# EAGLE schematic main (EAGLE 8.2.2)
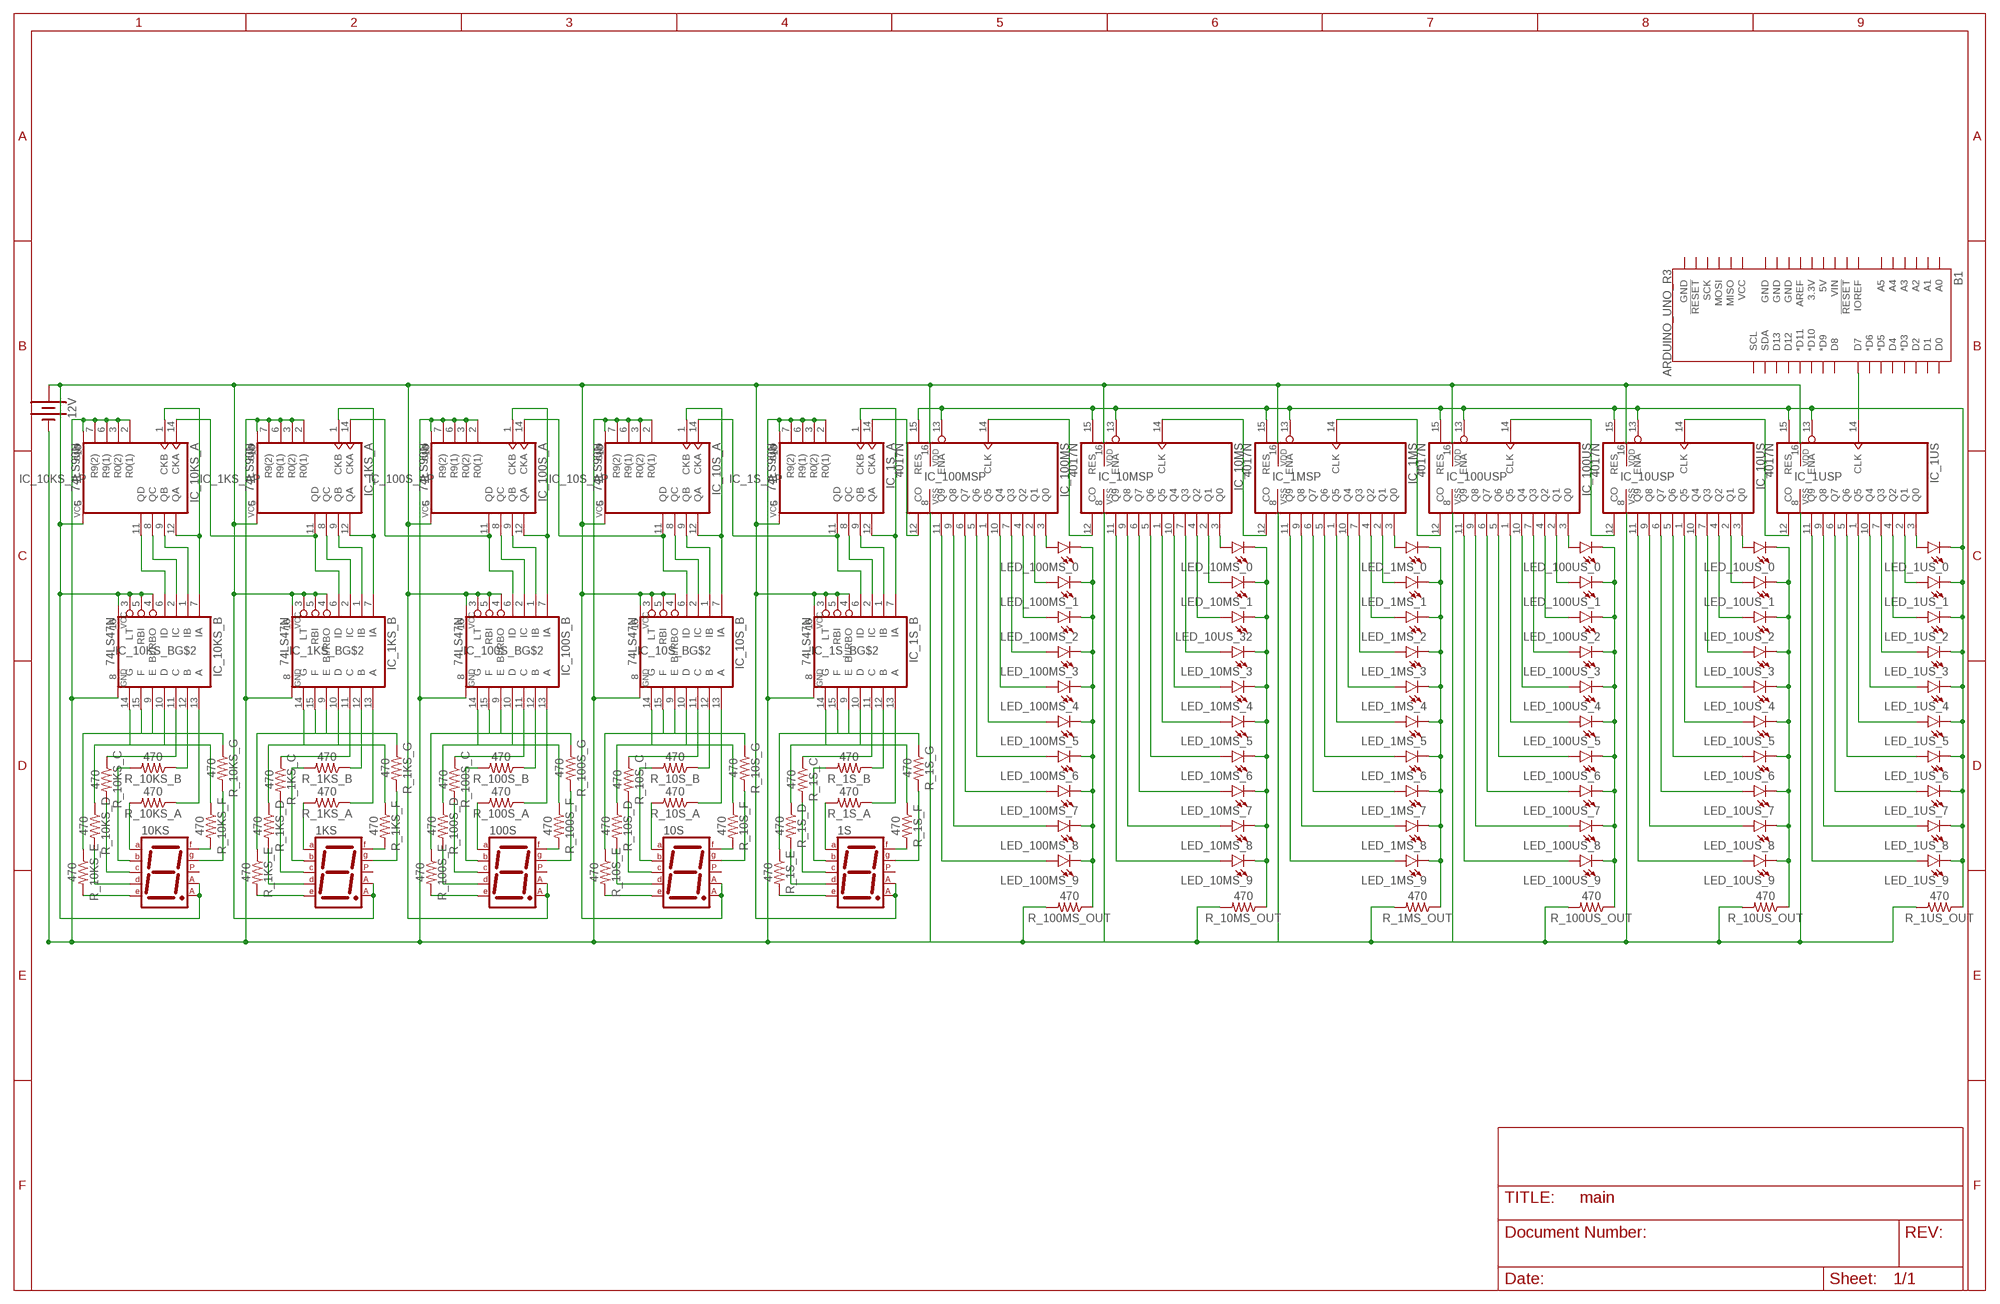
[diagram p0: schematic, sheet 1]

## Parts
1KS  7SEG-CA  [7SEG-13]
1S  7SEG-CA  [7SEG-13]
10KS  7SEG-CA  [7SEG-13]
10S  7SEG-CA  [7SEG-13]
12V  BATTERY-9V  [BATTCON_9V]
100S  7SEG-CA  [7SEG-13]
B1  ARDUINO_UNO_R3  [ARDUINO_R3]
IC_1KS_A  74LS90N  [DIL14]
IC_1KS_B  74LS47N  [DIL16]
IC_1MS  4017N  [DIL16]
IC_1S_A  74LS90N  [DIL14]
IC_1S_B  74LS47N  [DIL16]
IC_1US  4017N  [DIL16]
IC_10KS_A  74LS90N  [DIL14]
IC_10KS_B  74LS47N  [DIL16]
IC_10MS  4017N  [DIL16]
IC_10S_A  74LS90N  [DIL14]
IC_10S_B  74LS47N  [DIL16]
IC_10US  4017N  [DIL16]
IC_100MS  4017N  [DIL16]
IC_100S_A  74LS90N  [DIL14]
IC_100S_B  74LS47N  [DIL16]
IC_100US  4017N  [DIL16]
LED_1MS_0  LED3MM  [LED_3MM]
LED_1MS_1  LED3MM  [LED_3MM]
LED_1MS_2  LED3MM  [LED_3MM]
LED_1MS_3  LED3MM  [LED_3MM]
LED_1MS_4  LED3MM  [LED_3MM]
LED_1MS_5  LED3MM  [LED_3MM]
LED_1MS_6  LED3MM  [LED_3MM]
LED_1MS_7  LED3MM  [LED_3MM]
LED_1MS_8  LED3MM  [LED_3MM]
LED_1MS_9  LED3MM  [LED_3MM]
LED_1US_0  LED3MM  [LED_3MM]
LED_1US_1  LED3MM  [LED_3MM]
LED_1US_2  LED3MM  [LED_3MM]
LED_1US_3  LED3MM  [LED_3MM]
LED_1US_4  LED3MM  [LED_3MM]
LED_1US_5  LED3MM  [LED_3MM]
LED_1US_6  LED3MM  [LED_3MM]
LED_1US_7  LED3MM  [LED_3MM]
LED_1US_8  LED3MM  [LED_3MM]
LED_1US_9  LED3MM  [LED_3MM]
LED_10MS_0  LED3MM  [LED_3MM]
LED_10MS_1  LED3MM  [LED_3MM]
LED_10MS_3  LED3MM  [LED_3MM]
LED_10MS_4  LED3MM  [LED_3MM]
LED_10MS_5  LED3MM  [LED_3MM]
LED_10MS_6  LED3MM  [LED_3MM]
LED_10MS_7  LED3MM  [LED_3MM]
LED_10MS_8  LED3MM  [LED_3MM]
LED_10MS_9  LED3MM  [LED_3MM]
LED_10US_0  LED3MM  [LED_3MM]
LED_10US_1  LED3MM  [LED_3MM]
LED_10US_2  LED3MM  [LED_3MM]
LED_10US_3  LED3MM  [LED_3MM]
LED_10US_4  LED3MM  [LED_3MM]
LED_10US_5  LED3MM  [LED_3MM]
LED_10US_6  LED3MM  [LED_3MM]
LED_10US_7  LED3MM  [LED_3MM]
LED_10US_8  LED3MM  [LED_3MM]
LED_10US_9  LED3MM  [LED_3MM]
LED_10US_32  LED3MM  [LED_3MM]
LED_100MS_0  LED3MM  [LED_3MM]
LED_100MS_1  LED3MM  [LED_3MM]
LED_100MS_2  LED3MM  [LED_3MM]
LED_100MS_3  LED3MM  [LED_3MM]
LED_100MS_4  LED3MM  [LED_3MM]
LED_100MS_5  LED3MM  [LED_3MM]
LED_100MS_6  LED3MM  [LED_3MM]
LED_100MS_7  LED3MM  [LED_3MM]
LED_100MS_8  LED3MM  [LED_3MM]
LED_100MS_9  LED3MM  [LED_3MM]
LED_100US_0  LED3MM  [LED_3MM]
LED_100US_1  LED3MM  [LED_3MM]
LED_100US_2  LED3MM  [LED_3MM]
LED_100US_3  LED3MM  [LED_3MM]
LED_100US_4  LED3MM  [LED_3MM]
LED_100US_5  LED3MM  [LED_3MM]
LED_100US_6  LED3MM  [LED_3MM]
LED_100US_7  LED3MM  [LED_3MM]
LED_100US_8  LED3MM  [LED_3MM]
LED_100US_9  LED3MM  [LED_3MM]
R_1KS_A  470  470OHM-0603-1/10W-1%  [0603]
R_1KS_B  470  470OHM-0603-1/10W-1%  [0603]
R_1KS_C  470  470OHM-0603-1/10W-1%  [0603]
R_1KS_D  470  470OHM-0603-1/10W-1%  [0603]
R_1KS_E  470  470OHM-0603-1/10W-1%  [0603]
R_1KS_F  470  470OHM-0603-1/10W-1%  [0603]
R_1KS_G  470  470OHM-0603-1/10W-1%  [0603]
R_1MS_OUT  470  470OHM-0603-1/10W-1%  [0603]
R_1S_A  470  470OHM-0603-1/10W-1%  [0603]
R_1S_B  470  470OHM-0603-1/10W-1%  [0603]
R_1S_C  470  470OHM-0603-1/10W-1%  [0603]
R_1S_D  470  470OHM-0603-1/10W-1%  [0603]
R_1S_E  470  470OHM-0603-1/10W-1%  [0603]
R_1S_F  470  470OHM-0603-1/10W-1%  [0603]
R_1S_G  470  470OHM-0603-1/10W-1%  [0603]
R_1US_OUT  470  470OHM-0603-1/10W-1%  [0603]
R_10KS_A  470  470OHM-0603-1/10W-1%  [0603]
R_10KS_B  470  470OHM-0603-1/10W-1%  [0603]
R_10KS_C  470  470OHM-0603-1/10W-1%  [0603]
R_10KS_D  470  470OHM-0603-1/10W-1%  [0603]
R_10KS_E  470  470OHM-0603-1/10W-1%  [0603]
R_10KS_F  470  470OHM-0603-1/10W-1%  [0603]
R_10KS_G  470  470OHM-0603-1/10W-1%  [0603]
R_10MS_OUT  470  470OHM-0603-1/10W-1%  [0603]
R_10S_A  470  470OHM-0603-1/10W-1%  [0603]
R_10S_B  470  470OHM-0603-1/10W-1%  [0603]
R_10S_C  470  470OHM-0603-1/10W-1%  [0603]
R_10S_D  470  470OHM-0603-1/10W-1%  [0603]
R_10S_E  470  470OHM-0603-1/10W-1%  [0603]
R_10S_F  470  470OHM-0603-1/10W-1%  [0603]
R_10S_G  470  470OHM-0603-1/10W-1%  [0603]
R_10US_OUT  470  470OHM-0603-1/10W-1%  [0603]
R_100MS_OUT  470  470OHM-0603-1/10W-1%  [0603]
R_100S_A  470  470OHM-0603-1/10W-1%  [0603]
R_100S_B  470  470OHM-0603-1/10W-1%  [0603]
R_100S_C  470  470OHM-0603-1/10W-1%  [0603]
R_100S_D  470  470OHM-0603-1/10W-1%  [0603]
R_100S_E  470  470OHM-0603-1/10W-1%  [0603]
R_100S_F  470  470OHM-0603-1/10W-1%  [0603]
R_100S_G  470  470OHM-0603-1/10W-1%  [0603]
R_100US_OUT  470  470OHM-0603-1/10W-1%  [0603]

## Nets
N$1: IC_1US.3(Q0) LED_1US_0.A
N$2: IC_1US.2(Q1) LED_1US_1.A
N$3: IC_1US.4(Q2) LED_1US_2.A
N$4: IC_1US.7(Q3) LED_1US_3.A
N$5: IC_1US.10(Q4) LED_1US_4.A
N$6: IC_1US.1(Q5) LED_1US_5.A
N$7: IC_1US.5(Q6) LED_1US_6.A
N$8: IC_1US.6(Q7) LED_1US_7.A
N$9: IC_1US.9(Q8) LED_1US_8.A
N$10: IC_1US.11(Q9) LED_1US_9.A
N$11: IC_1MS.13(ENA) IC_1MS.15(RES) IC_1US.13(ENA) IC_1US.15(RES) IC_10MS.13(ENA) IC_10MS.15(RES) IC_10US.13(ENA) IC_10US.15(RES) IC_100MS.13(ENA) IC_100MS.15(RES) IC_100US.13(ENA) IC_100US.15(RES) LED_1US_0.K(C) LED_1US_1.K(C) LED_1US_2.K(C) LED_1US_3.K(C) LED_1US_4.K(C) LED_1US_5.K(C) LED_1US_6.K(C) LED_1US_7.K(C) LED_1US_8.K(C) LED_1US_9.K(C) R_1US_OUT.1
N$12: B1.D7 IC_1US.14(CLK)
N$13: IC_10US.3(Q0) LED_10US_0.A
N$14: IC_1S_A.14(CKA) IC_100MS.12(CO)
N$15: IC_1S_A.1(CKB) IC_1S_A.12(QA) IC_1S_B.7(IA)
N$16: IC_10US.2(Q1) LED_10US_1.A
N$17: IC_10US.4(Q2) LED_10US_2.A
N$18: IC_10US.7(Q3) LED_10US_3.A
N$19: IC_10US.10(Q4) LED_10US_4.A
N$20: IC_10US.1(Q5) LED_10US_5.A
N$21: IC_10US.5(Q6) LED_10US_6.A
N$22: IC_10US.6(Q7) LED_10US_7.A
N$23: IC_10US.9(Q8) LED_10US_8.A
N$24: IC_10US.11(Q9) LED_10US_9.A
N$25: LED_10US_0.K(C) LED_10US_1.K(C) LED_10US_2.K(C) LED_10US_3.K(C) LED_10US_4.K(C) LED_10US_5.K(C) LED_10US_6.K(C) LED_10US_7.K(C) LED_10US_8.K(C) LED_10US_9.K(C) R_10US_OUT.1
N$26: 12V.- IC_1S_A.2(R0(1)) IC_1S_A.3(R0(2)) IC_1S_A.6(R9(1)) IC_1S_A.7(R9(2)) IC_1S_A.10(GND) IC_1S_B.8(GND) IC_1US.8(VSS) IC_10US.8(VSS) R_1MS_OUT.2 R_1US_OUT.2 R_10MS_OUT.2 R_10US_OUT.2 R_100MS_OUT.2 R_100US_OUT.2
N$28: IC_1US.12(CO) IC_10US.14(CLK)
N$29: IC_100US.3(Q0) LED_100US_0.A
N$30: IC_100US.2(Q1) LED_100US_1.A
N$31: IC_100US.4(Q2) LED_100US_2.A
N$32: IC_100US.7(Q3) LED_100US_3.A
N$33: IC_100US.10(Q4) LED_100US_4.A
N$34: IC_100US.1(Q5) LED_100US_5.A
N$35: IC_100US.5(Q6) LED_100US_6.A
N$36: IC_100US.6(Q7) LED_100US_7.A
N$37: IC_100US.9(Q8) LED_100US_8.A
N$38: IC_100US.11(Q9) LED_100US_9.A
N$39: LED_100US_0.K(C) LED_100US_1.K(C) LED_100US_2.K(C) LED_100US_3.K(C) LED_100US_4.K(C) LED_100US_5.K(C) LED_100US_6.K(C) LED_100US_7.K(C) LED_100US_8.K(C) LED_100US_9.K(C) R_100US_OUT.1
N$40: IC_1S_A.9(QB) IC_1S_B.1(IB)
N$41: IC_100US.8(VSS)
N$42: IC_10US.12(CO) IC_100US.14(CLK)
N$43: IC_1MS.3(Q0) LED_1MS_0.A
N$44: IC_1MS.2(Q1) LED_1MS_1.A
N$45: IC_1MS.4(Q2) LED_1MS_2.A
N$46: IC_1MS.7(Q3) LED_1MS_3.A
N$47: IC_1MS.10(Q4) LED_1MS_4.A
N$48: IC_1MS.1(Q5) LED_1MS_5.A
N$49: IC_1MS.5(Q6) LED_1MS_6.A
N$50: IC_1MS.6(Q7) LED_1MS_7.A
N$51: IC_1MS.9(Q8) LED_1MS_8.A
N$52: IC_1MS.11(Q9) LED_1MS_9.A
N$53: LED_1MS_0.K(C) LED_1MS_1.K(C) LED_1MS_2.K(C) LED_1MS_3.K(C) LED_1MS_4.K(C) LED_1MS_5.K(C) LED_1MS_6.K(C) LED_1MS_7.K(C) LED_1MS_8.K(C) LED_1MS_9.K(C) R_1MS_OUT.1
N$54: IC_1S_A.8(QC) IC_1S_B.2(IC)
N$55: IC_1MS.8(VSS)
N$56: IC_1MS.14(CLK) IC_100US.12(CO)
N$57: IC_10MS.3(Q0) LED_10MS_0.A
N$58: IC_10MS.2(Q1) LED_10MS_1.A
N$59: IC_10MS.4(Q2) LED_10US_32.A
N$60: IC_10MS.7(Q3) LED_10MS_3.A
N$61: IC_10MS.10(Q4) LED_10MS_4.A
N$62: IC_10MS.1(Q5) LED_10MS_5.A
N$63: IC_10MS.5(Q6) LED_10MS_6.A
N$64: IC_10MS.6(Q7) LED_10MS_7.A
N$65: IC_10MS.9(Q8) LED_10MS_8.A
N$66: IC_10MS.11(Q9) LED_10MS_9.A
N$67: LED_10MS_0.K(C) LED_10MS_1.K(C) LED_10MS_3.K(C) LED_10MS_4.K(C) LED_10MS_5.K(C) LED_10MS_6.K(C) LED_10MS_7.K(C) LED_10MS_8.K(C) LED_10MS_9.K(C) LED_10US_32.K(C) R_10MS_OUT.1
N$69: IC_10MS.8(VSS)
N$70: IC_1MS.12(CO) IC_10MS.14(CLK)
N$71: IC_100MS.3(Q0) LED_100MS_0.A
N$72: IC_100MS.2(Q1) LED_100MS_1.A
N$73: IC_100MS.4(Q2) LED_100MS_2.A
N$74: IC_100MS.7(Q3) LED_100MS_3.A
N$75: IC_100MS.10(Q4) LED_100MS_4.A
N$76: IC_100MS.1(Q5) LED_100MS_5.A
N$77: IC_100MS.5(Q6) LED_100MS_6.A
N$78: IC_100MS.6(Q7) LED_100MS_7.A
N$79: IC_100MS.9(Q8) LED_100MS_8.A
N$80: IC_100MS.11(Q9) LED_100MS_9.A
N$81: LED_100MS_0.K(C) LED_100MS_1.K(C) LED_100MS_2.K(C) LED_100MS_3.K(C) LED_100MS_4.K(C) LED_100MS_5.K(C) LED_100MS_6.K(C) LED_100MS_7.K(C) LED_100MS_8.K(C) LED_100MS_9.K(C) R_100MS_OUT.1
N$82: IC_1S_B.9(E) R_1S_E.1
N$83: IC_100MS.8(VSS)
N$84: IC_10MS.12(CO) IC_100MS.14(CLK)
N$85: 1S.3(CA1) 1S.8(CA2) 12V.+ IC_1MS.16(VDD) IC_1S_A.5(VCC) IC_1S_B.3(LT) IC_1S_B.4(BI/RBO) IC_1S_B.5(RBI) IC_1S_B.16(VCC) IC_1US.16(VDD) IC_10MS.16(VDD) IC_10US.16(VDD) IC_100MS.16(VDD) IC_100US.16(VDD)
N$86: IC_1S_B.10(D) R_1S_D.1
N$87: IC_1S_B.11(C) R_1S_C.1
N$88: IC_1S_B.12(B) R_1S_B.1
N$89: 1S.7(A) R_1S_A.2
N$90: IC_1S_B.13(A) R_1S_A.1
N$91: 1S.10(G) R_1S_G.2
N$92: 1S.1(E) R_1S_E.2
N$93: 1S.2(D) R_1S_D.2
N$94: 1S.4(C) R_1S_C.2
N$95: 1S.6(B) R_1S_B.2
N$96: IC_1S_B.15(F) R_1S_G.1
N$97: IC_1S_B.14(G) R_1S_F.1
N$98: 1S.9(F) R_1S_F.2
N$99: 10S.3(CA1) 10S.8(CA2) IC_10S_A.5(VCC) IC_10S_B.3(LT) IC_10S_B.4(BI/RBO) IC_10S_B.5(RBI) IC_10S_B.16(VCC)
N$100: IC_1S_A.11(QD) IC_1S_B.6(ID) IC_10S_A.14(CKA)
N$101: IC_10S_A.1(CKB) IC_10S_A.12(QA) IC_10S_B.7(IA)
N$102: IC_10S_A.2(R0(1)) IC_10S_A.3(R0(2)) IC_10S_A.6(R9(1)) IC_10S_A.7(R9(2)) IC_10S_A.10(GND) IC_10S_B.8(GND)
N$103: IC_10S_A.9(QB) IC_10S_B.1(IB)
N$104: IC_10S_A.8(QC) IC_10S_B.2(IC)
N$106: 10S.1(E) R_10S_E.2
N$107: 10S.2(D) R_10S_D.2
N$108: 10S.4(C) R_10S_C.2
N$109: 10S.6(B) R_10S_B.2
N$110: IC_10S_B.15(F) R_10S_G.1
N$111: IC_10S_B.9(E) R_10S_E.1
N$112: IC_10S_B.10(D) R_10S_D.1
N$113: IC_10S_B.11(C) R_10S_C.1
N$114: IC_10S_B.12(B) R_10S_B.1
N$115: 10S.7(A) R_10S_A.2
N$116: IC_10S_B.13(A) R_10S_A.1
N$117: IC_10S_B.14(G) R_10S_F.1
N$118: 10S.9(F) R_10S_F.2
N$119: 10S.10(G) R_10S_G.2
N$141: 100S.3(CA1) 100S.8(CA2) IC_100S_A.5(VCC) IC_100S_B.3(LT) IC_100S_B.4(BI/RBO) IC_100S_B.5(RBI) IC_100S_B.16(VCC)
N$142: IC_10S_A.11(QD) IC_10S_B.6(ID) IC_100S_A.14(CKA)
N$143: IC_100S_A.1(CKB) IC_100S_A.12(QA) IC_100S_B.7(IA)
N$144: IC_100S_A.2(R0(1)) IC_100S_A.3(R0(2)) IC_100S_A.6(R9(1)) IC_100S_A.7(R9(2)) IC_100S_A.10(GND) IC_100S_B.8(GND)
N$145: IC_100S_A.9(QB) IC_100S_B.1(IB)
N$146: IC_100S_A.8(QC) IC_100S_B.2(IC)
N$148: 100S.1(E) R_100S_E.2
N$149: 100S.2(D) R_100S_D.2
N$150: 100S.4(C) R_100S_C.2
N$151: 100S.6(B) R_100S_B.2
N$152: IC_100S_B.15(F) R_100S_G.1
N$153: IC_100S_B.9(E) R_100S_E.1
N$154: IC_100S_B.10(D) R_100S_D.1
N$155: IC_100S_B.11(C) R_100S_C.1
N$156: IC_100S_B.12(B) R_100S_B.1
N$157: 100S.7(A) R_100S_A.2
N$158: IC_100S_B.13(A) R_100S_A.1
N$159: IC_100S_B.14(G) R_100S_F.1
N$160: 100S.9(F) R_100S_F.2
N$161: 100S.10(G) R_100S_G.2
N$162: 1KS.3(CA1) 1KS.8(CA2) IC_1KS_A.5(VCC) IC_1KS_B.3(LT) IC_1KS_B.4(BI/RBO) IC_1KS_B.5(RBI) IC_1KS_B.16(VCC)
N$163: IC_1KS_A.14(CKA) IC_100S_A.11(QD) IC_100S_B.6(ID)
N$164: IC_1KS_A.1(CKB) IC_1KS_A.12(QA) IC_1KS_B.7(IA)
N$165: IC_1KS_A.2(R0(1)) IC_1KS_A.3(R0(2)) IC_1KS_A.6(R9(1)) IC_1KS_A.7(R9(2)) IC_1KS_A.10(GND) IC_1KS_B.8(GND)
N$166: IC_1KS_A.9(QB) IC_1KS_B.1(IB)
N$167: IC_1KS_A.8(QC) IC_1KS_B.2(IC)
N$169: 1KS.1(E) R_1KS_E.2
N$170: 1KS.2(D) R_1KS_D.2
N$171: 1KS.4(C) R_1KS_C.2
N$172: 1KS.6(B) R_1KS_B.2
N$173: IC_1KS_B.15(F) R_1KS_G.1
N$174: IC_1KS_B.9(E) R_1KS_E.1
N$175: IC_1KS_B.10(D) R_1KS_D.1
N$176: IC_1KS_B.11(C) R_1KS_C.1
N$177: IC_1KS_B.12(B) R_1KS_B.1
N$178: 1KS.7(A) R_1KS_A.2
N$179: IC_1KS_B.13(A) R_1KS_A.1
N$180: IC_1KS_B.14(G) R_1KS_F.1
N$181: 1KS.9(F) R_1KS_F.2
N$182: 1KS.10(G) R_1KS_G.2
N$183: 10KS.3(CA1) 10KS.8(CA2) IC_10KS_A.5(VCC) IC_10KS_B.3(LT) IC_10KS_B.4(BI/RBO) IC_10KS_B.5(RBI) IC_10KS_B.16(VCC)
N$184: IC_1KS_A.11(QD) IC_1KS_B.6(ID) IC_10KS_A.14(CKA)
N$185: IC_10KS_A.1(CKB) IC_10KS_A.12(QA) IC_10KS_B.7(IA)
N$186: IC_10KS_A.2(R0(1)) IC_10KS_A.3(R0(2)) IC_10KS_A.6(R9(1)) IC_10KS_A.7(R9(2)) IC_10KS_A.10(GND) IC_10KS_B.8(GND)
N$187: IC_10KS_A.9(QB) IC_10KS_B.1(IB)
N$188: IC_10KS_A.8(QC) IC_10KS_B.2(IC)
N$189: IC_10KS_A.11(QD) IC_10KS_B.6(ID)
N$190: 10KS.1(E) R_10KS_E.2
N$191: 10KS.2(D) R_10KS_D.2
N$192: 10KS.4(C) R_10KS_C.2
N$193: 10KS.6(B) R_10KS_B.2
N$194: IC_10KS_B.15(F) R_10KS_G.1
N$195: IC_10KS_B.9(E) R_10KS_E.1
N$196: IC_10KS_B.10(D) R_10KS_D.1
N$197: IC_10KS_B.11(C) R_10KS_C.1
N$198: IC_10KS_B.12(B) R_10KS_B.1
N$199: 10KS.7(A) R_10KS_A.2
N$200: IC_10KS_B.13(A) R_10KS_A.1
N$201: IC_10KS_B.14(G) R_10KS_F.1
N$202: 10KS.9(F) R_10KS_F.2
N$203: 10KS.10(G) R_10KS_G.2
Unconnected: 1KS.5(DP) 1S.5(DP) 10KS.5(DP) 10S.5(DP) 100S.5(DP) B1.3.3V B1.5V B1.A0 B1.A1 B1.A2 B1.A3 B1.A4 B1.A5 B1.AREF B1.D0 B1.D1 B1.D2 B1.D3(*D3) B1.D4 B1.D5(*D5) B1.D6(*D6) B1.D8 B1.D9(*D9) B1.D10(*D10) B1.D11(*D11) B1.D12 B1.D13 B1.GND@1(GND) B1.GND@2(GND) B1.GND@3(GND) B1.GND@4(GND) B1.IOREF B1.MISO B1.MOSI B1.RESET@1(!RESET!) B1.RESET@2(!RESET!) B1.SCK B1.SCL B1.SDA B1.VCC B1.VIN

## Library data of the parts
1KS 1S 10KS 10S 100S = special:7SEG-CA: 7-segment DISPLAY single anode, 13 mm
12V = SparkFun-Batteries:BATTERY: Battery - Single Cell A variety of battery chemistries, sizes, and footprints. Device List: 20MM_PTH - Coin Cell Battery Holder - 20mm (PTH) <https://www.sparkfun.com/products/783> 6.8MM_PTH - Coin Cell Battery Holder - 6.8MM(SMD) <https://www.digikey.com/product-detail/en/seiko-instruments/MS621FE-FL11E/728-1057-ND/1889208?WT.srch=1&gclid=CNOQ5a6LzdQCFZS2wAodXCkE0g> 12MM_SMD - Coin Cell Battery Holder - 12mm (SMD) <https://www.sparkfun.com/products/10592> 12MM_PTH - Coin Cell Battery Holder - 12mm (PTH) <https://www.sparkfun.com/products/7948> 20MM_SMD - 20mm Coin Cell Battery Holder (SMD) (2 legs) Used on the Big Time Watch Kit <https://www.sparkfun.com/products/11734> 20MM_SMD_4LEGS - Coin Cell Battery Holder - 20mm (SMD) <https://www.sparkfun.com/products/11892> 20MM_SMD_4LEGS_OVERPASTE - Coin Cell Battery Holder - 20mm (SMD) <https://www.sparkfun.com/products/11892> (Over-paste on the legs) 24.5MM_PTH - Coin Cell Battery Holder - 24.5mm (PTH) <https://www.sparkfun.com/products/8863> 9V - 9V Battery Holder - PC Mount Used on the SparkFun SparkPunk Sound Kit <https://www.sparkfun.com/products/11177> and SparkFun SparkPunk Sequencer Kit <https://www.sparkfun.com/products/12707> 18650 - Battery Holder - 18650 (PTH) <https://www.sparkfun.com/products/13113> AA - Battery Holder - 1xAA (PTH) <https://www.sparkfun.com/products/7949> AAA - Battery Holder - 1xAAA (PTH) <https://www.sparkfun.com/products/12718> AA_KIT - Battery Holder - 1xAA (PTH) <https://www.sparkfun.com/products/7949> Special kit package - pads only have exposed copper on one side of the board. AAA_KIT - Battery Holder - 1xAAA (PTH) <https://www.sparkfun.com/products/12718> Special kit package - pads only have exposed copper on one side of the board.; PROD_ID: BATT-10855
B1 = SparkFun-Boards:ARDUINO_UNO_R3: Arduino R3 Footprint with SPI header Arduino Uno R3 Compatible Footprint. Matches PCB size of the original board. SparkFun Products: SAMD21 Dev Breakout <https://www.sparkfun.com/products/13672> RedBoard <https://www.sparkfun.com/products/12757> R3 Stackable Headers <https://www.sparkfun.com/products/11417>
IC_1KS_A IC_1S_A IC_10KS_A IC_10S_A IC_100S_A = 74xx-us:74*90: Decade, divide by twelve and binary COUNTER
IC_1KS_B IC_1S_B IC_10KS_B IC_10S_B IC_100S_B = 74xx-us:74*47: BCD to seven segment DECODER/DRIVER Source: http://www.ee.washington.edu/stores/DataSheets/74ls/74ls47.pdf
IC_1MS IC_1US IC_10MS IC_10US IC_100MS IC_100US = 40xx:4017: COUNTER/DIVIDER
LED_1MS_0 LED_1MS_1-LED_1MS_9 LED_1US_0 LED_1US_1-LED_1US_9 LED_10MS_0 LED_10MS_1 LED_10MS_3-LED_10MS_9 LED_10US_0 LED_10US_1-LED_10US_9 LED_10US_32 LED_100MS_0 LED_100MS_1-LED_100MS_9 LED_100US_0 LED_100US_1-LED_100US_9 = SparkFun-LED:LED: LED (Generic) Standard schematic elements and footprints for 5mm, 3mm, 1206, and 0603 sized LEDs. Generic LEDs with no color specified.; PROD_ID: DIO-08794
R_1KS_A R_1KS_B R_1KS_C R_1KS_D R_1KS_E R_1KS_F R_1KS_G R_1MS_OUT R_1S_A R_1S_B R_1S_C R_1S_D R_1S_E R_1S_F R_1S_G R_1US_OUT R_10KS_A R_10KS_B R_10KS_C R_10KS_D R_10KS_E R_10KS_F R_10KS_G R_10MS_OUT R_10S_A R_10S_B R_10S_C R_10S_D R_10S_E R_10S_F R_10S_G R_10US_OUT R_100MS_OUT R_100S_A R_100S_B R_100S_C R_100S_D R_100S_E R_100S_F R_100S_G R_100US_OUT = SparkFun-Resistors:470OHM: 470Ω resistor A resistor is a passive two-terminal electrical component that implements electrical resistance as a circuit element. Resistors act to reduce current flow, and, at the same time, act to lower voltage levels within circuits. - Wikipedia; PROD_ID: RES-07869